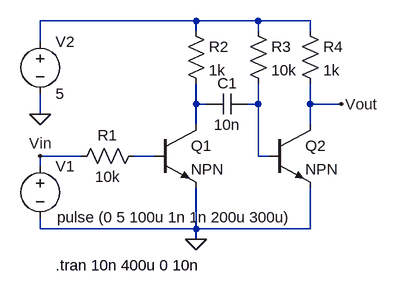
[diagram p0: schematic pulse-gen.asc]
pulse-gen.asc, the LTspice schematic file:
Version 4
SHEET 1 560 376
WIRE 144 -16 -96 -16
WIRE 240 -16 144 -16
WIRE 320 -16 240 -16
WIRE 144 0 144 -16
WIRE 240 0 240 -16
WIRE 320 0 320 -16
WIRE -96 16 -96 -16
WIRE 144 112 144 80
WIRE 160 112 144 112
WIRE 240 112 240 80
WIRE 240 112 224 112
WIRE 320 112 320 80
WIRE 368 112 320 112
WIRE -96 128 -96 96
WIRE 144 144 144 112
WIRE 320 144 320 112
WIRE -32 192 -96 192
WIRE 80 192 48 192
WIRE 240 192 240 112
WIRE 256 192 240 192
WIRE -96 208 -96 192
WIRE -96 304 -96 288
WIRE 144 304 144 240
WIRE 144 304 -96 304
WIRE 320 304 320 240
WIRE 320 304 144 304
WIRE 144 320 144 304
FLAG 144 320 0
FLAG 368 112 Vout
FLAG -96 192 Vin
FLAG -96 128 0
SYMBOL Res 64 176 R90
WINDOW 0 0 56 VBottom 2
WINDOW 3 32 56 VTop 2
SYMATTR InstName R1
SYMATTR Value 10k
SYMBOL Res 128 -16 R0
SYMATTR InstName R2
SYMATTR Value 1k
SYMBOL Res 224 -16 R0
SYMATTR InstName R3
SYMATTR Value 10k
SYMBOL Res 304 -16 R0
SYMATTR InstName R4
SYMATTR Value 1k
SYMBOL Cap 224 96 R90
WINDOW 0 0 32 VBottom 2
WINDOW 3 32 32 VTop 2
SYMATTR InstName C1
SYMATTR Value 10n
SYMBOL npn 80 144 R0
SYMATTR InstName Q1
SYMBOL npn 256 144 R0
SYMATTR InstName Q2
SYMBOL Voltage -96 192 R0
WINDOW 3 26 94 Left 2
SYMATTR InstName V1
SYMATTR Value pulse (0 5 100u 1n 1n 200u 300u)
SYMBOL Voltage -96 0 R0
SYMATTR InstName V2
SYMATTR Value 5
TEXT -72 360 Left 2 !.tran 10n 400u 0 10n

The netlist it stands for:
* pulse-gen.asc
R1 N004 Vin 10k
R2 N001 N002 1k
R3 N001 N003 10k
R4 N001 Vout 1k
C1 N003 N002 10n
Q1 N002 N004 0 0 NPN
Q2 Vout N003 0 0 NPN
V1 Vin 0 pulse (0 5 100u 1n 1n 200u 300u)
V2 N001 0 5
.model NPN NPN
.model PNP PNP
.lib standard.bjt
.tran 10n 400u 0 10n
.backanno
.end